# Altium schematic sheet SH4 - CONNECTORS.SchDoc
size Letter
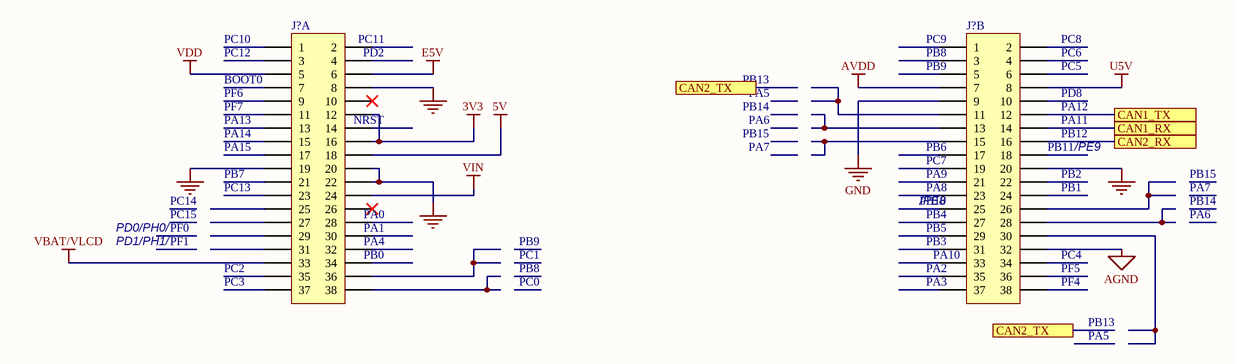
[diagram p0: SH4 - CONNECTORS.SchDoc]

## Parts
(Parts that share a designator on the sheet are numbered #1, #2 ... from top to bottom, then left to right.)
J?#1  HEADER_NUCLEO  [HEADER_NUCLEO]  (value not drawn)  (part A of 2)
J?#2  HEADER_NUCLEO  [HEADER_NUCLEO]  (value not drawn)  (part B of 2)

## Ports
CAN1_RX, CAN1_TX, CAN2_RX, CAN2_TX

## Nets
3V3: J?#1.12 J?#1.16
5V: J?#1.18
AGND: J?#2.70(32)
AVDD: J?#2.45(7)
E5V: J?#1.6
GND: J?#1.8 J?#1.19 J?#1.20 J?#1.22 J?#2.47(9) J?#2.58(20)
U5V: J?#2.46(8)
VBAT/VLCD: J?#1.33
VDD: J?#1.5
VIN: J?#1.24
CAN1_RX: J?#2.52(14) ; port CAN1_RX
CAN1_TX: J?#2.50(12) ; port CAN1_TX
CAN2_RX: J?#2.54(16) ; port CAN2_RX

Not connected (* = marked no-connect by the designer): J?#1 1 2 3 4 7 9 10* 11 13 14 15 17 21 23 25 26* 27 28 29 30 31 32 34 35 36 37 38; J?#2 39(1) 40(2) 41(3) 42(4) 43(5) 44(6) 48(10) 49(11) 51(13) 53(15) 55(17) 56(18) 57(19) 59(21) 60(22) 61(23) 62(24) 63(25) 64(26) 65(27) 66(28) 67(29) 68(30) 69(31) 71(33) 72(34) 73(35) 74(36) 75(37) 76(38)

## Notes on the sheet
- (near J?#1) PC10
- (near J?#1) PC12
- (near J?#1) BOOT0
- (near J?#1) PC11
- (near J?#1) PD2
- PB13
- (near J?#2) PC9
- (near J?#2) PB8
- (near J?#2) PB9
- (near J?#2) PC8
- (near J?#2) PC6
- (near J?#2) PC5
- (near J?#1) PF7
- (near J?#1) PF6
- (near J?#1) PA13
- (near J?#1) PA14
- (near J?#1) PA15
- (near J?#1) NRST
- PA5
- PB14
- PA6
- PB15
- PA7
- (near J?#2) PB6
- (near J?#2) PB11
- (near J?#2) PD8
- (near J?#2) PA12
- (near J?#2) PA11
- (near J?#2) PB12
- /PE9
- PC14
- PC15
- (near J?#1) PB7
- (near J?#1) PC13
- (near J?#1) PA0
- (near J?#2) PB10
- (near J?#2) /PE8
- (near J?#2) PC7
- (near J?#2) PA9
- (near J?#2) PA8
- (near J?#2) PB4
- (near J?#2) PB1
- (near J?#2) PB2
- PD0/PH0/
- PD1/PH1/
- PF0
- PF1
- (near J?#1) PC2
- (near J?#1) PC3
- (near J?#1) PA1
- (near J?#1) PA4
- (near J?#1) PB0
- PB9
- PC1
- PB8
- PC0
- (near J?#2) PB5
- (near J?#2) PB3
- (near J?#2) PA2
- (near J?#2) PA3
- (near J?#2) PA10
- (near J?#2) PC4
- (near J?#2) PF4
- (near J?#2) PF5
- Title
- Size:
- Date:
- Letter
- Drawn By:
- Sheet
- of
- File:

## Library data of the parts
J?#1 J?#2 = HEADER_NUCLEO: Board Connector, 38 Contact(s), 2 Row(s), Female, Straight, 0.1 inch Pitch, Solder Terminal, Locking; Manufacturer 1: Sullins; Manufacturer Part Number 1: PPPC192LFBN-RC; Connector Type: Header,Socket; Number of Positions: 38; Supplier 1: Digi-Key; RoHS: Yes; Category: Connectors; Stock 1: 2393; Pricing 1: 1=2.26000, 10=2.05100, 100=1.75770, 500=1.46476, 1000=1.25550, 5000=1.20900 (USD); Mount: Through Hole; Color: Black; Contact Plating: Gold; Housing Material: Plastic; Contact Material: Bronze; Package Quantity: 1000; Number of Rows: 2; Packaging: Bulk; Termination: Solder; Length: 48.8mm; Height: 8.5mm; Pitch: 0.1inch; Row Spacing: 0.1inch; Width: 5mm; Lead Free: Lead Free; ComponentLink1URL: https://datasheet.ciiva.com:443/pdfs/VipMasterIC/IC/SUCS/SUCSS00270/SUCSS00270-1.pdf?src-supplier=IHS+Markit; ComponentLink1Description: https://datasheet.ciiva.com:443/pdfs/VipMasterIC/IC/SUCS/SUCSS00270/SUCSS00270-1.pdf?src-supplier=IHS+Markit; ComponentLink2URL: https://media.digikey.com/pdf/Data%20Sheets/Sullins%20PDFs/Female_Headers.100_DS.pdf?src-supplier=Digi-Key; ComponentLink2Description: https://media.digikey.com/pdf/Data%20Sheets/Sullins%20PDFs/Female_Headers.100_DS.pdf?src-supplier=Digi-Key; Supplier Part Number 1: S7122-ND